# Altium schematic sheet Energetski_dio.SchDoc
size A4
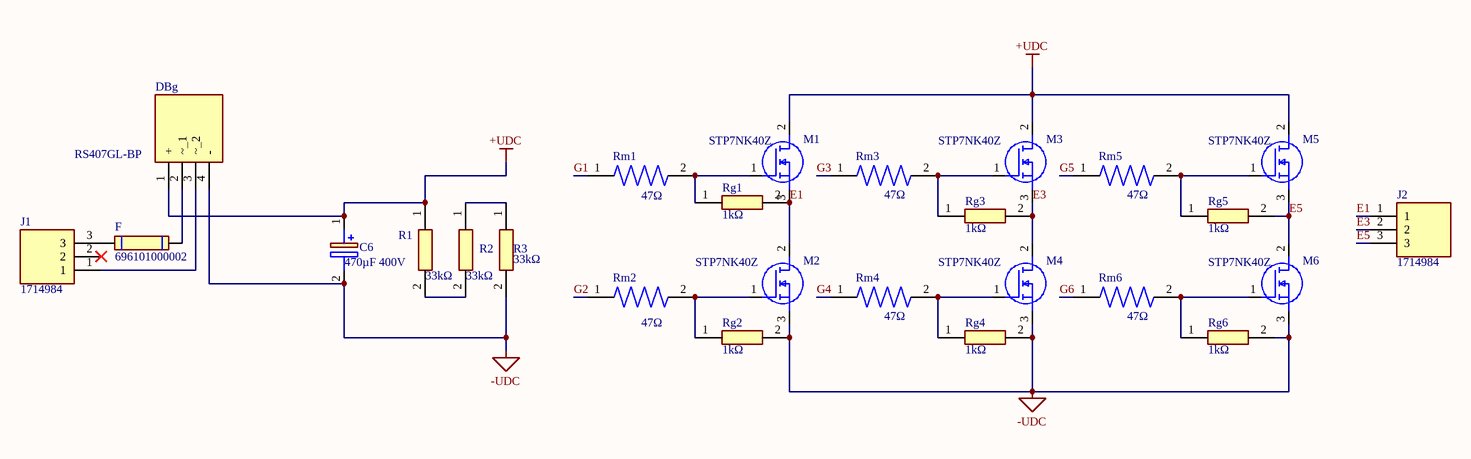
[diagram p0: Energetski_dio.SchDoc]

## Parts
C6  470µF 400V  [6]
DBg  RS407GL-BP  [10]
F  696101000002  [696101000002]
J1  1714984  [3]
J2  1714984  [3]
M1  STP7NK40Z  [2]
M2  STP7NK40Z  [2]
M3  STP7NK40Z  [2]
M4  STP7NK40Z  [2]
M5  STP7NK40Z  [2]
M6  STP7NK40Z  [2]
R1  33kΩ  [18]
R2  33kΩ  [18]
R3  33kΩ  [18]
Rg1  1kΩ  [RESAD1590W60L630D240]
Rg2  1kΩ  [RESAD1590W60L630D240]
Rg3  1kΩ  [RESAD1590W60L630D240]
Rg4  1kΩ  [RESAD1590W60L630D240]
Rg5  1kΩ  [RESAD1590W60L630D240]
Rg6  1kΩ  [RESAD1590W60L630D240]
Rm1  47Ω  [17]
Rm2  47Ω  [17]
Rm3  47Ω  [17]
Rm4  47Ω  [17]
Rm5  47Ω  [17]
Rm6  47Ω  [17]

## Nets
+UDC: C6.1(+) DBg.1(+) M1.2(D) M3.2(D) M5.2(D) R1.1
-UDC: C6.2(-) DBg.4(-) M2.3(S) M4.3(S) M6.3(S) R3.2 Rg2.2 Rg4.2 Rg6.2
E1: J2.1 M1.3(S) M2.2(D) Rg1.2
E3: J2.2 M3.3(S) M4.2(D) Rg3.2
E5: J2.3 M5.3(S) M6.2(D) Rg5.2
G1: Rm1.1
G2: Rm2.1
G3: Rm3.1
G4: Rm4.1
G5: Rm5.1
G6: Rm6.1
NetDBg_2: DBg.2(~_1) F.2
NetDBg_3: DBg.3(~_2) J1.1
NetF_1: F.1 J1.3
NetM1_1: M1.1(G) Rg1.1 Rm1.2
NetM2_1: M2.1(G) Rg2.1 Rm2.2
NetM3_1: M3.1(G) Rg3.1 Rm3.2
NetM4_1: M4.1(G) Rg4.1 Rm4.2
NetM5_1: M5.1(G) Rg5.1 Rm5.2
NetM6_1: M6.1(G) Rg6.1 Rm6.2
NetR1_2: R1.2 R2.2
NetR2_1: R2.1 R3.1

Not connected (* = marked no-connect by the designer): J1 2*

## Library data of the parts
C6 = LLG2G471MELB35_1: Capacitor Polarised; Manufacturer_Name: Nichicon; Datasheet Link: http://nichicon-us.com/english/products/pdfs/e-llg.pdf; Height: 37mm; Manufacturer_Part_Number: LLG2G471MELB35; Mouser Part Number: 647-LLG2G471MELB35; Mouser Price/Stock: https://www.mouser.co.uk/ProductDetail/Nichicon/LLG2G471MELB35?qs=4lWw5qRttGISEzjV5TZARQ%3D%3D; Arrow Part Number: LLG2G471MELB35; Arrow Price/Stock: https://www.arrow.com/en/products/llg2g471melb35/nichicon?region=europe
DBg = RS407GL-BP: Bridge Rectifier; Manufacturer_Name: MCC; Datasheet Link: https://www.mccsemi.com/pdf/Products/RS401GL-RS407GL(RS-4L).pdf; Height: 16.3mm; Manufacturer_Part_Number: RS407GL-BP; Mouser Part Number: 833-RS407GL-BP; Mouser Price/Stock: https://www.mouser.co.uk/ProductDetail/Micro-Commercial-Components-MCC/RS407GL-BP?qs=SdqRYZZ9IxAW3J9C4U9fBg%3D%3D; Arrow Part Number: RS407GL-BP; Arrow Price/Stock: https://www.arrow.com/en/products/rs407gl-bp/micro-commercial-components?region=nac
F = 696101000002: Fuse Block 10 A 250V 1 Circuit Cartridge Through Hole; MF: Wurth Elektronik; Value: *; SnapEDA_Link: https://www.snapeda.com/parts/696101000002/Wurth+Elektronik/view-part/?ref=snap; MP: 696101000002; Purchase-URL: https://pricing.snapeda.com/search/part/696101000002/?ref=eda; Check_prices: https://www.snapeda.com/parts/696101000002/Wurth+Elektronik/view-part/?ref=eda; Availability: In Stock; Price: None; Package: None
J1 J2 = 1714984: Connector; Manufacturer_Name: Phoenix Contact; Datasheet Link: https://www.phoenixcontact.com/online/portal/us/?uri=pxc-oc-itemdetail:pid=1714984&library=usen&pcck=P-11-01-05&tab=1&selectedCategory=ALL; Height: 21.7mm; Manufacturer_Part_Number: 1714984; Mouser Part Number: 651-1714984; Mouser Price/Stock: https://www.mouser.co.uk/ProductDetail/Phoenix-Contact/1714984?qs=cyzODkzcbwBLTTPxtXl6gQ%3D%3D; Arrow Part Number: 1714984; Arrow Price/Stock: https://www.arrow.com/en/products/1714984/phoenix-contact?region=nac
M1-M6 = STP7NK40ZFP: MOSFET (N-Channel); Manufacturer_Name: STMicroelectronics; Datasheet Link: http://www.st.com/web/en/resource/technical/document/datasheet/CD00003040.pdf; Height: 4.6mm; Manufacturer_Part_Number: STP7NK40ZFP; Mouser Part Number: 511-STP7NK40ZFP; Mouser Price/Stock: https://www.mouser.com/Search/Refine.aspx?Keyword=511-STP7NK40ZFP; Arrow Part Number: STP7NK40ZFP; Arrow Price/Stock: https://www.arrow.com/en/products/stp7nk40zfp/stmicroelectronics
R1-R3 = CFR-50JB-52-33K: Resistor; Manufacturer_Name: KEMET; Datasheet Link: https://datasheet.datasheetarchive.com/originals/distributors/Datasheets_SAMA/cf5c7c7b14e59499e9125003e6ee5ce2.pdf; Manufacturer_Part_Number: CFR-50JB-52-33K; Mouser Part Number: 603-CFR-50JB-52-33K; Mouser Price/Stock: https://www.mouser.co.uk/ProductDetail/YAGEO/CFR-50JB-52-33K?qs=oypCK0zG3245HXmmN0J37w%3D%3D; Arrow Part Number: CFR-50JB-52-33K; Arrow Price/Stock: https://www.arrow.com/en/products/cfr-50jb-52-33k/yageo?region=nac
Rg1-Rg6 = CFR-25JB-52-1K: Resistor; Manufacturer_Name: KEMET; Datasheet Link: http://www.mouser.com/datasheet/2/447/Yageo LR_CFR_2013-595289.pdf; Manufacturer_Part_Number: CFR-25JB-52-1K; Mouser Part Number: N/A; Mouser Price/Stock: https://www.mouser.co.uk/ProductDetail/Yageo/CFR-25JB-52-1K/?qs=oypCK0zG326Dzm6bUFS4DQ%3D%3D; Arrow Part Number: CFR-25JB-52-1K; Arrow Price/Stock: https://www.arrow.com/en/products/cfr-25jb-52-1k/yageo
Rm1 Rm2 Rm4-Rm6 = 2-1623928-5: 470 Ohms Â±5% 0.25W, 1/4W Through Hole Resistor Axial - Carbon Film; Tolerance: 5%; Resistance: 470; Voltage_Rating: 200 V; MF: TE Connectivity; Power_Rating: .25 W; Value: *; SnapEDA_Link: https://www.snapeda.com/parts/2-1623928-5/TE+Connectivity/view-part/?ref=snap; EU_RoHS_Compliance: Compliant; Availability: In Stock; Price: None; Package: None; Check_prices: https://www.snapeda.com/parts/2-1623928-5/TE+Connectivity/view-part/?ref=eda; MP: 2-1623928-5; Comment_1: *
Rm3 = 2-1623928-5: 470 Ohms Â±5% 0.25W, 1/4W Through Hole Resistor Axial - Carbon Film; Tolerance: 5%; Resistance: 47; Voltage_Rating: 200 V; MF: TE Connectivity; Power_Rating: .25 W; Value: *; SnapEDA_Link: https://www.snapeda.com/parts/2-1623928-5/TE+Connectivity/view-part/?ref=snap; EU_RoHS_Compliance: Compliant; Availability: In Stock; Price: None; Package: None; Check_prices: https://www.snapeda.com/parts/2-1623928-5/TE+Connectivity/view-part/?ref=eda; MP: 2-1623928-5; Comment_1: *